# EAGLE schematic lora_esp (EAGLE 9.5.2)
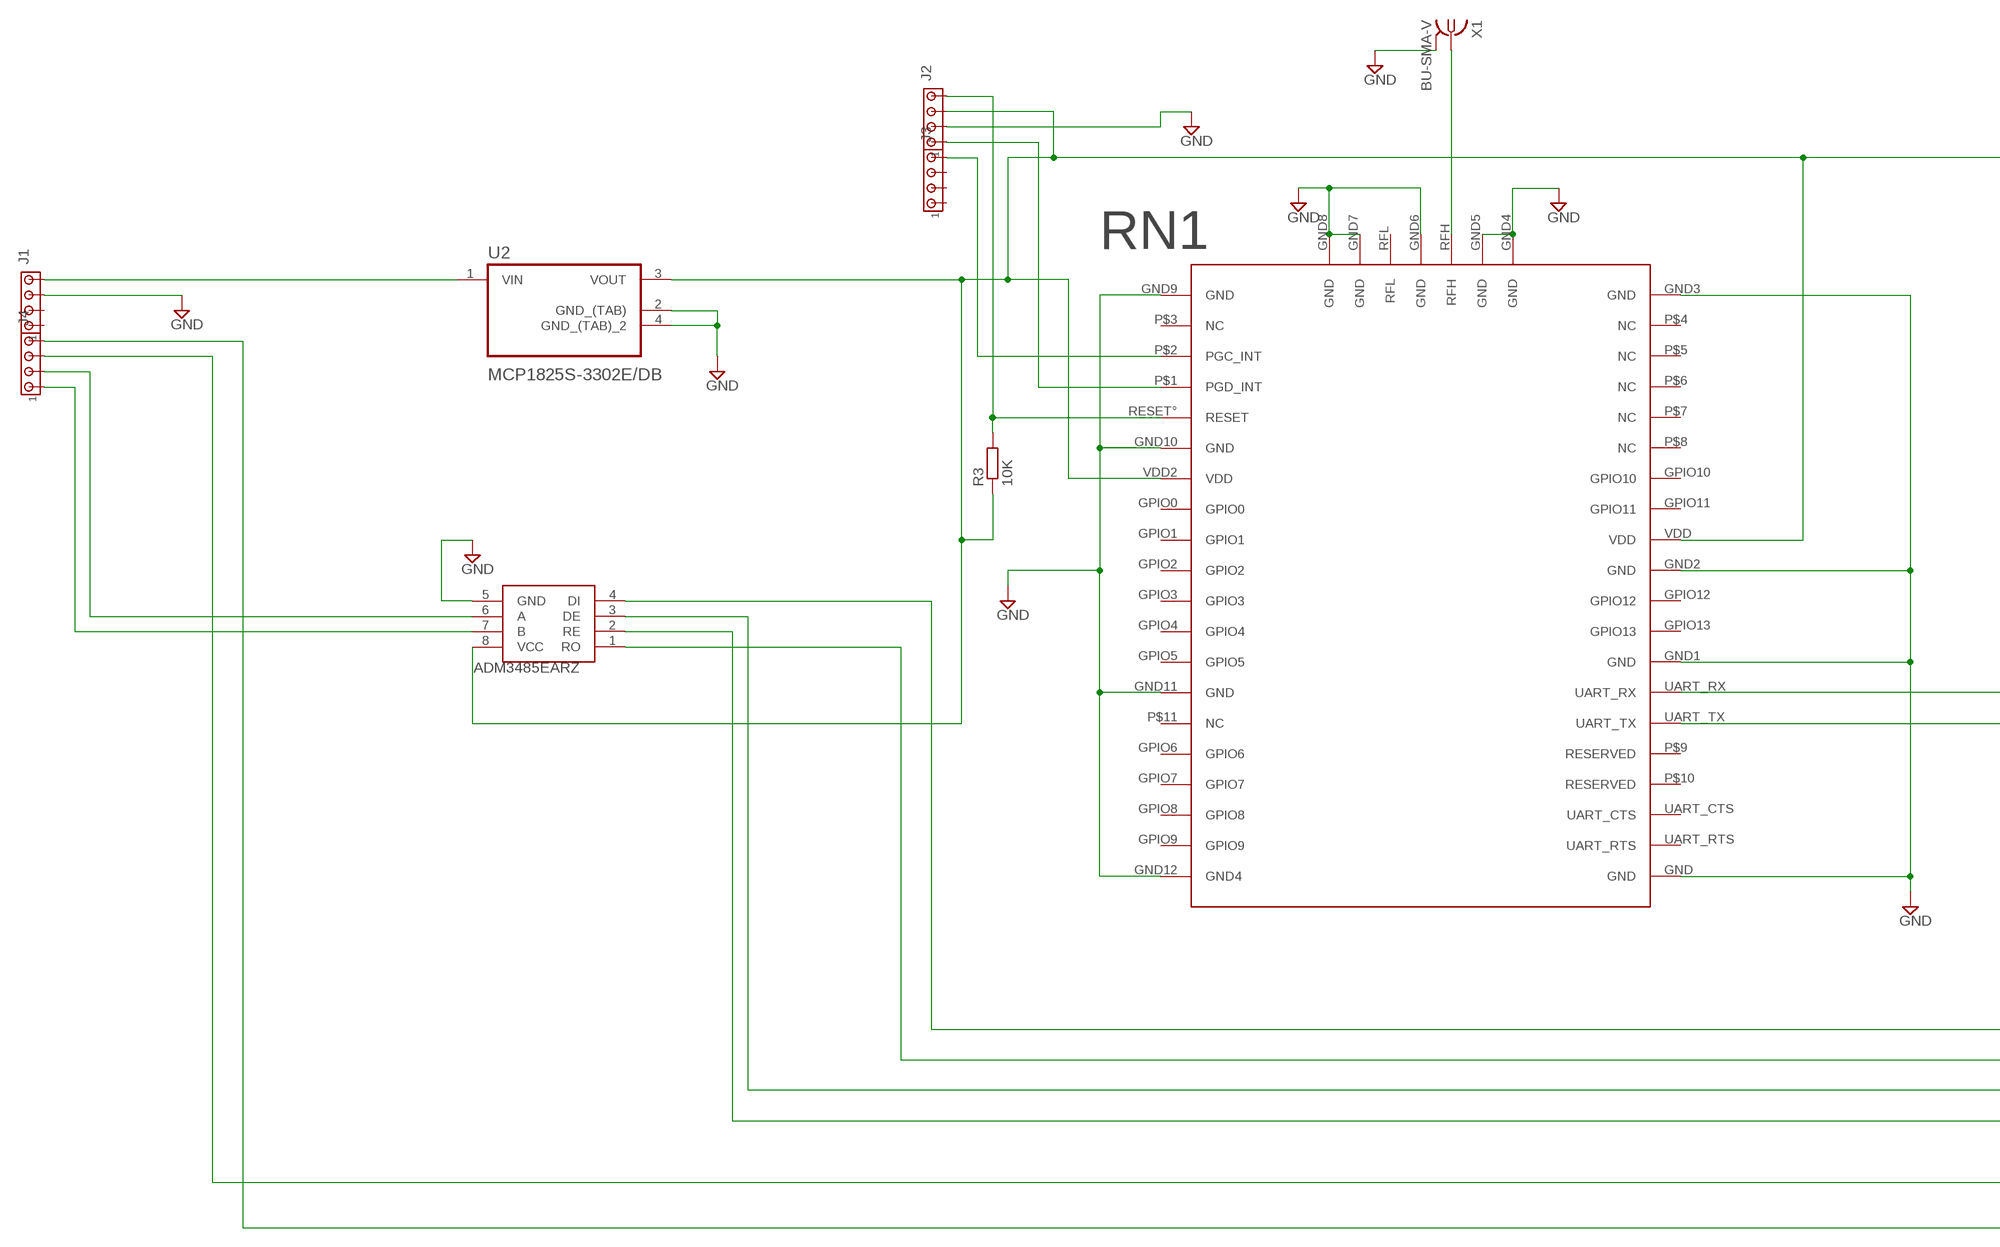
[diagram p0: schematic, sheet 1, part 1 of 2]
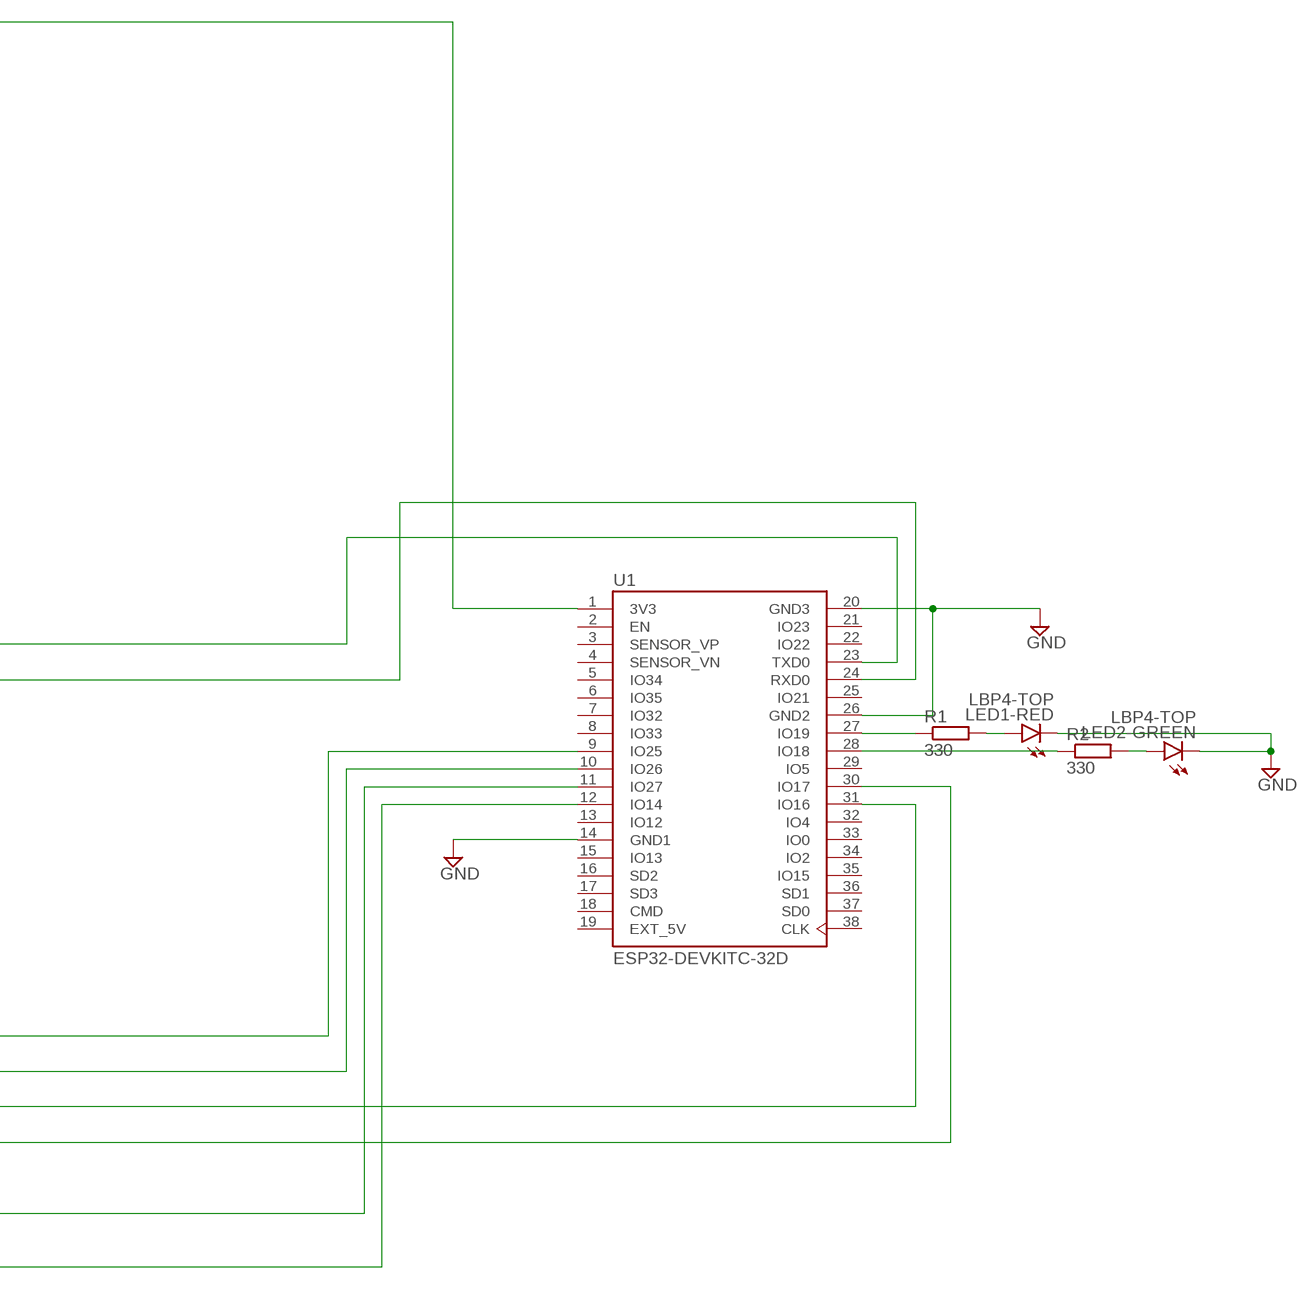
[diagram p1: schematic, sheet 1, part 2 of 2]

## Parts
ADM3485EARZ  AMD3485E  [AMD3485E]
J1  MTA04-100  [10X04MTA]
J2  MTA04-100  [10X04MTA]
J3  MTA04-100  [10X04MTA]
J4  MTA04-100  [10X04MTA]
LED1-RED  LBP4-TOP  [P47F-TOP]
LED2-GREEN  LBP4-TOP  [P47F-TOP]
R1  330  R-EU_0204/5  [0204/5]
R2  330  R-EU_0204/5  [0204/5]
R3  10K  R-EU_0204/5  [0204/5]
RN1  NEW_RN2483  [NEW_RN2483]
U1  ESP32-DEVKITC-32D  [MODULE_ESP32-DEVKITC-32D]
U2  MCP1825S-3302E/DB  [SOT230P700X180-4N]
X1  BU-SMA-V  [BU-SMA-V]

## Nets
3V3: ADM3485EARZ.8(VCC) J2.3 R3.1 RN1.VDD RN1.VDD2(VDD) U1.1(3V3) U2.3(VOUT)
GND: ADM3485EARZ.5(GND) J1.3 J2.2 LED1-RED.C LED2-GREEN.C RN1.GND RN1.GND1(GND) RN1.GND2(GND) RN1.GND3(GND) RN1.GND4(GND) RN1.GND5(GND) RN1.GND6(GND) RN1.GND7(GND) RN1.GND8(GND) RN1.GND9(GND) RN1.GND10(GND) RN1.GND11(GND) RN1.GND12(GND4) U1.14(GND1) U1.20(GND3) U1.26(GND2) U2.2(GND_(TAB)) U2.4(GND_(TAB)_2) X1.2 X1.3 X1.4 X1.5
N$1: J1.4 U2.1(VIN)
N$2: J2.4 R3.2 RN1.RESET°(RESET)
N$4: RN1.RFH X1.1
N$6: J2.1 RN1.P$1(PGD_INT)
N$7: J3.4 RN1.P$2(PGC_INT)
N$8: R1.1 U1.27(IO19)
N$10: ADM3485EARZ.4(DI) U1.9(IO25)
N$11: ADM3485EARZ.1(RO) U1.10(IO26)
N$12: ADM3485EARZ.6(A) J4.2
N$13: ADM3485EARZ.2(RE) U1.30(IO17)
N$14: ADM3485EARZ.7(B) J4.1
N$15: RN1.UART_RX U1.23(TXD0)
N$16: RN1.UART_TX U1.24(RXD0)
N$17: ADM3485EARZ.3(DE) U1.31(IO16)
N$18: J4.3 U1.11(IO27)
N$19: J4.4 U1.12(IO14)
N$20: LED1-RED.A R1.2
N$22: LED2-GREEN.A R2.2
N$23: R2.1 U1.28(IO18)
Unconnected: J1.1 J1.2 J3.1 J3.2 J3.3 RN1.GPIO0 RN1.GPIO1 RN1.GPIO2 RN1.GPIO3 RN1.GPIO4 RN1.GPIO5 RN1.GPIO6 RN1.GPIO7 RN1.GPIO8 RN1.GPIO9 RN1.GPIO10 RN1.GPIO11 RN1.GPIO12 RN1.GPIO13 RN1.P$3(NC) RN1.P$4(NC) RN1.P$5(NC) RN1.P$6(NC) RN1.P$7(NC) RN1.P$8(NC) RN1.P$9(RESERVED) RN1.P$10(RESERVED) RN1.P$11(NC) RN1.RFL RN1.UART_CTS RN1.UART_RTS U1.2(EN) U1.3(SENSOR_VP) U1.4(SENSOR_VN) U1.5(IO34) U1.6(IO35) U1.7(IO32) U1.8(IO33) U1.13(IO12) U1.15(IO13) U1.16(SD2) U1.17(SD3) U1.18(CMD) U1.21(IO23) U1.22(IO22) U1.25(IO21) U1.29(IO5) U1.32(IO4) U1.33(IO0) U1.34(IO2) U1.35(IO15) U1.36(SD1) U1.37(SD0) U1.38(CLK)

## Power pins joined to a net without a drawn wire
EXT_5V: U1.19(EXT_5V)

## Library data of the parts
ADM3485EARZ = AMD3485E:AMD3485E
J1-J4 = con-amp:MTA04-100: AMP connector
LED1-RED LED2-GREEN = led:*P4: PointLED® Enhanced Thinfilm LED TOP & BOTTOM mount LS P47F, LR P47F, LA P47F, LY P47F, LT P4SG, LB P4SG, LW P4SG Source: http://catalog.osram-os.com .. LA_LR_LS_LY_P47F_Pb_free.pdf
R1-R3 = rcl:R-EU_: RESISTOR, European symbol; SPICEPREFIX: R
RN1 = tobias:NEW_RN2483
U1 = ESP32-DEVKITC-32D (1):ESP32-DEVKITC-32D: Eval Board For Esp-Wroom-32; AVAILABILITY: Unavailable; DESCRIPTION: - Transceiver; 802.11 b/g/n (Wi-Fi, WiFi, WLAN), Bluetooth® Smart Ready 4.x Dual Mode For Use With ESP-WROOM-32; MF: Espressif Systems; MP: ESP32-DEVKITC-32D; PACKAGE: None; PRICE: None
U2 = MCP1825S-3302E_DB:MCP1825S-3302E/DB; AVAILABILITY: Unavailable; DESCRIPTION: Linear Voltage Regulator IC 1 Output 500mA SOT-223-3; MF: Microchip; MP: MCP1825S-3302E/DB; PACKAGE: SOT-223 Microchip; PRICE: None
X1 = con-coax:BU-SMA-V: FEMALE SMA CONNECTOR Radiall distributor RS 112-3794; OC_FARNELL: unknown; OC_NEWARK: unknown